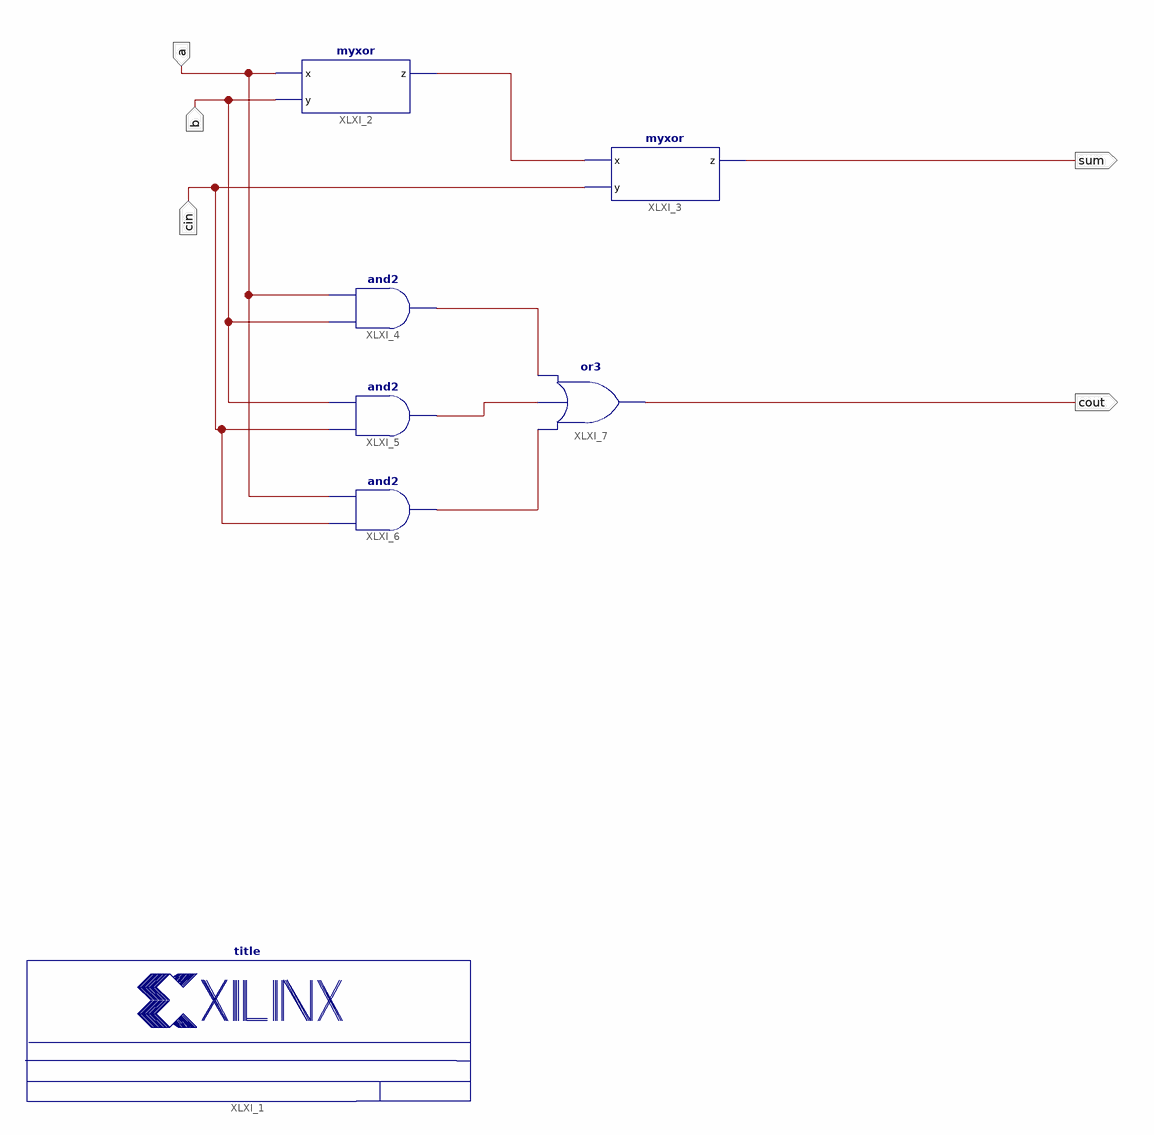
[diagram p0: schematic sheet 1]
// Xilinx ISE schematic full_adder_sch.sch (spartan3e) as structural Verilog: 7 symbols, 5 ports
module full_adder_sch (
  input  a,
  input  b,
  input  cin,
  output sum,
  output cout
);

  wire XLXN_1, XLXN_18, XLXN_20, XLXN_21;

  title #(.NameFieldText("Full adder")) XLXI_1 ();
  myxor XLXI_2 (.x(a), .y(b), .z(XLXN_1));
  myxor XLXI_3 (.x(XLXN_1), .y(cin), .z(sum));
  and XLXI_4 (XLXN_18, b, a);
  and XLXI_5 (XLXN_20, cin, b);
  and XLXI_6 (XLXN_21, cin, a);
  or XLXI_7 (cout, XLXN_21, XLXN_20, XLXN_18);
endmodule
